# Altium project PCB_15122020_01BB.PrjPcb (part 1 of 9)
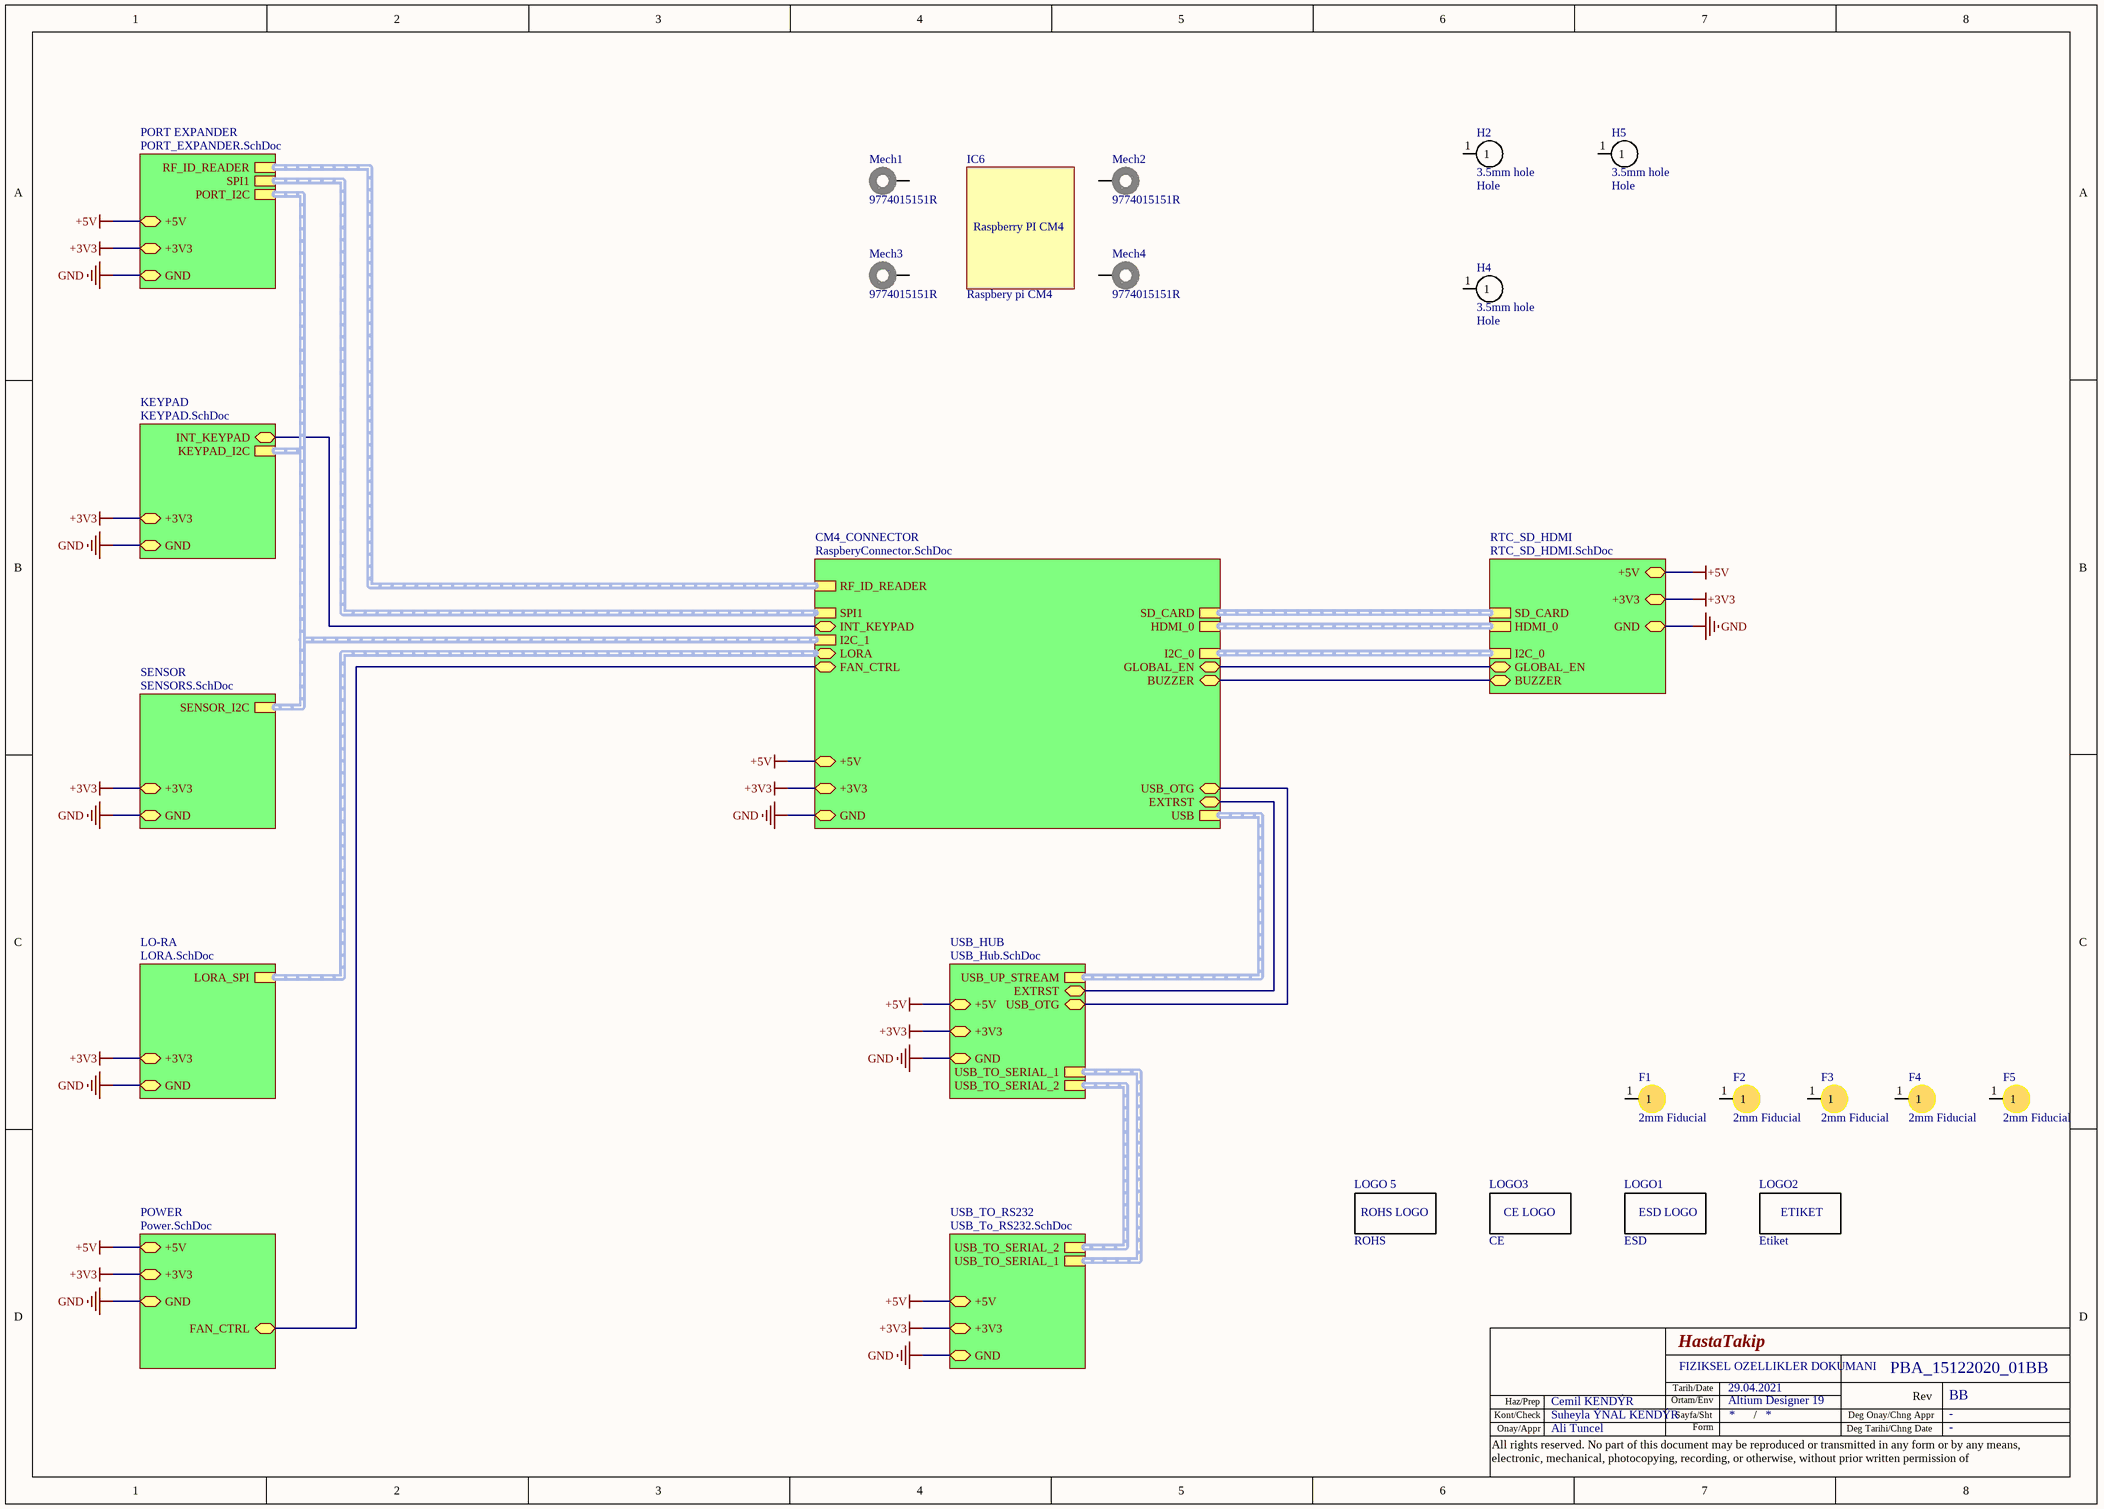
[diagram p0: Main.SchDoc]
DocumentName: FIZIKSEL OZELLIKLER DOKUMANI; FO_ApprovedBy: -; FO_CheckedBy: Cemil KENDÝR; pApprovedBy: Ali Tuncel; pCheckedBy: Suheyla ÝNAL KENDÝR; pDesignedBy: Cemil KENDÝR; pDesignEnvironment: Altium Designer 19; pDocumentNumber: PBA_15122020_01BB; pDrawnBy: Cemil KENDÝR; pFoDate: 29.04.2021; pFoRevision: 01; pModifiedBy: -; pModifiedDate: -; pPBACode: 01; pPBADescription: HastaTakip; pPBARevision: BB; pPreparedBy: Cemil KENDÝR; pProjectCode: 15122020; pProjectName: Hasta Takip; pReleaseDate: 29.04.2021
9 sheets, 663 parts. Net scope: hierarchical (ports join the sheet entries above them; power ports are global).
Board file: PCB_15122020_01BB.PcbDoc
Sheets:
  Main.SchDoc
    USB_TO_RS232 = USB_To_RS232.SchDoc
      RS232_1 = RS232.SchDoc
      RS232_2 = RS232.SchDoc
      RS232_3 = RS232.SchDoc
      RS232_4 = RS232.SchDoc
      RS232_5 = RS232.SchDoc
      RS232_6 = RS232.SchDoc
      RS232_7 = RS232.SchDoc
      RS232_8 = RS232.SchDoc
    USB_HUB = USB_Hub.SchDoc
    CM4_CONNECTOR = RaspberyConnector.SchDoc
    POWER = Power.SchDoc
    PORT EXPANDER = PORT_EXPANDER.SchDoc
    SENSOR = SENSORS.SchDoc
    RTC_SD_HDMI = RTC_SD_HDMI.SchDoc

## Sheet Main.SchDoc
size A3

### Parts
F1  2mm Fiducial  [2mm Fiducial]
F2  2mm Fiducial  [2mm Fiducial]
F3  2mm Fiducial  [2mm Fiducial]
F4  2mm Fiducial  [2mm Fiducial]
F5  2mm Fiducial  [2mm Fiducial]
H2  3.5mm hole  Category: Hole  [3.5mm hole]
H4  3.5mm hole  Category: Hole  [3.5mm hole]
H5  3.5mm hole  Category: Hole  [3.5mm hole]
IC6  Raspbery pi CM4  [CM4_BOARD_SIDE]
LOGO1  ESD  [ESD]
LOGO2  Etiket  [ETIKET]
LOGO3  CE  [CE]
LOGO_5  ROHS  [ROHS]
Mech1  9774015151R  [9774015151]
Mech2  9774015151R  [9774015151]
Mech3  9774015151R  [9774015151]
Mech4  9774015151R  [9774015151]

### Sub-sheets
CM4_CONNECTOR = RaspberyConnector.SchDoc: USB (harness USB), +5V (bidir), +3V3 (bidir), GND (bidir), HDMI_0 (harness HDMI), I2C_0 (harness I2C), GLOBAL_EN (bidir), BUZZER (bidir), SD_CARD (harness SD_CARD), EXTRST (bidir), I2C_1 (harness I2C), INT_KEYPAD (bidir), SPI1 (harness SPI), RF_ID_READER (harness SPI), LORA (bidir, harness SPI), FAN_CTRL (bidir), USB_OTG (bidir)
KEYPAD = KEYPAD.SchDoc (file not in this document): KEYPAD_I2C (harness I2C), INT_KEYPAD (bidir), +3V3 (bidir), GND (bidir)
LO-RA = LORA.SchDoc (file not in this document): +3V3 (bidir), GND (bidir), LORA_SPI (harness SPI)
PORT EXPANDER = PORT_EXPANDER.SchDoc: +3V3 (bidir), GND (bidir), PORT_I2C (harness I2C), SPI1 (harness SPI), RF_ID_READER (harness SPI), +5V (bidir)
POWER = Power.SchDoc: +5V (bidir), +3V3 (bidir), GND (bidir), FAN_CTRL (bidir)
RTC_SD_HDMI = RTC_SD_HDMI.SchDoc: +5V (bidir), +3V3 (bidir), GND (bidir), I2C_0 (harness I2C), HDMI_0 (harness HDMI), GLOBAL_EN (bidir), BUZZER (bidir), SD_CARD (harness SD_CARD)
SENSOR = SENSORS.SchDoc: SENSOR_I2C (harness I2C), +3V3 (bidir), GND (bidir)
USB_HUB = USB_Hub.SchDoc: USB_UP_STREAM (harness USB), USB_TO_SERIAL_1 (harness USB), USB_TO_SERIAL_2 (harness USB), +5V (bidir), +3V3 (bidir), GND (bidir), EXTRST (bidir), USB_OTG (bidir)
USB_TO_RS232 = USB_To_RS232.SchDoc: USB_TO_SERIAL_2 (harness USB), USB_TO_SERIAL_1 (harness USB), +3V3 (bidir), GND (bidir), +5V (bidir)

### Nets
+3V3: sheet USB_TO_RS232/+3V3, sheet USB_HUB/+3V3, sheet CM4_CONNECTOR/+3V3, sheet POWER/+3V3, sheet KEYPAD/+3V3, sheet PORT EXPANDER/+3V3, sheet SENSOR/+3V3, sheet LO-RA/+3V3, sheet RTC_SD_HDMI/+3V3
+5V: sheet USB_TO_RS232/+5V, sheet USB_HUB/+5V, sheet CM4_CONNECTOR/+5V, sheet POWER/+5V, sheet PORT EXPANDER/+5V, sheet RTC_SD_HDMI/+5V
GND: sheet USB_TO_RS232/GND, sheet USB_HUB/GND, sheet CM4_CONNECTOR/GND, sheet POWER/GND, sheet KEYPAD/GND, sheet PORT EXPANDER/GND, sheet SENSOR/GND, sheet LO-RA/GND, sheet RTC_SD_HDMI/GND
BUZZER: sheet CM4_CONNECTOR/BUZZER, sheet RTC_SD_HDMI/BUZZER
GLOBAL_EN_PIN: sheet CM4_CONNECTOR/GLOBAL_EN, sheet RTC_SD_HDMI/GLOBAL_EN
GPIO19: sheet CM4_CONNECTOR/INT_KEYPAD, sheet KEYPAD/INT_KEYPAD
GPIO23: sheet CM4_CONNECTOR/FAN_CTRL, sheet POWER/FAN_CTRL
nEXTRST: sheet USB_HUB/EXTRST, sheet CM4_CONNECTOR/EXTRST
USB_OTG_ID: sheet USB_HUB/USB_OTG, sheet CM4_CONNECTOR/USB_OTG

Not connected (* = marked no-connect by the designer): F1 1; F2 1; F3 1; F4 1; F5 1; H2 1; H4 1; H5 1; Mech1 1; Mech2 1; Mech3 1; Mech4 1

### Buses and harness runs
harness sheet CM4_CONNECTOR/HDMI_0 = sheet RTC_SD_HDMI/HDMI_0
harness sheet CM4_CONNECTOR/I2C_0 = sheet RTC_SD_HDMI/I2C_0
harness sheet CM4_CONNECTOR/I2C_1 = sheet KEYPAD/KEYPAD_I2C = sheet PORT EXPANDER/PORT_I2C = sheet SENSOR/SENSOR_I2C
harness sheet CM4_CONNECTOR/LORA = sheet LO-RA/LORA_SPI
harness sheet CM4_CONNECTOR/RF_ID_READER = sheet PORT EXPANDER/RF_ID_READER
harness sheet CM4_CONNECTOR/SD_CARD = sheet RTC_SD_HDMI/SD_CARD
harness sheet CM4_CONNECTOR/SPI1 = sheet PORT EXPANDER/SPI1
harness sheet CM4_CONNECTOR/USB = sheet USB_HUB/USB_UP_STREAM
harness sheet USB_HUB/USB_TO_SERIAL_1 = sheet USB_TO_RS232/USB_TO_SERIAL_1
harness sheet USB_HUB/USB_TO_SERIAL_2 = sheet USB_TO_RS232/USB_TO_SERIAL_2

### Notes on the sheet
- Tarih/Date
- Kont/Check
- Onay/Appr
- Haz/Prep
- Ortam/Env
- Sayfa/Sht
- Form
- /
- Deg Tarihi/Chng Date
- Deg Onay/Chng Appr
- Rev
- All rights reserved. No part of this document may be reproduced or transmitted in any form or by any means, electronic, mechanical, photocopying, recording, or otherwise, without prior written permission of
- (in symbol CM4) Raspberry PI CM4
- (in symbol Etiket) ETIKET
- (in symbol ROHS) ROHS LOGO

### Library data of the parts
H2 H4 H5 = 3.5mm hole: 3.5mm delik
IC6 = CM4: Category: Module
LOGO1 = ESD: ESD LOGO; Category: Logo
LOGO2 = Etiket: Etiket kutu; Category: Logo
LOGO3 = CE: CE LOGO
LOGO_5 = ROHS: ROHS Logo
Mech1-Mech4 = 9774015151R: RND STNDFF M2.5X0.45 STEEL 1.5MM; Manufacturer: Wurth Electronics; Plating: Tin; Threaded/Unthreaded: Threaded; Outside Diameter: 0.201inch; Supplier 1: Digi-Key; Supplier Part Number 1: 732-7068-1-ND; Manufacturer Part Number: 9774015151R; Stock 1: 20988; Pricing 1: 1 = 1,09000, 10 = 1,03000, 50 = 0,91800, 100 = 0,84000, 500 = 0,78400 (USD); RoHS: Yes; Material: Steel; Length: 0.114inch; REACH SVHC: Unknown; ComponentLink1URL: http://www.mouser.com/ds/2/445/9774015151R-611426.pdf?src-supplier=Mouser; ComponentLink1Description: http://www.mouser.com/ds/2/445/9774015151R-611426.pdf?src-supplier=Mouser; ComponentLink2URL: http://www.farnell.com/datasheets/1960360.pdf?src-supplier=Farnell; ComponentLink2Description: http://www.farnell.com/datasheets/1960360.pdf?src-supplier=Farnell; ComponentLink3URL: https://media.digikey.com/pdf/Data%20Sheets/Wurth%20Electronics%20PDFs/WA-SMSx_Performance_Flyer.pdf?src-supplier=Digi-Key; ComponentLink3Description: https://media.digikey.com/pdf/Data%20Sheets/Wurth%20Electronics%20PDFs/WA-SMSx_Performance_Flyer.pdf?src-supplier=Digi-Key; ComponentLink4URL: http://www.farnell.com/datasheets/1960360.pdf?src-supplier=Element14; ComponentLink4Description: http://www.farnell.com/datasheets/1960360.pdf?src-supplier=Element14; ComponentLink5URL: http://www.farnell.com/datasheets/1960360.pdf?src-supplier=Newark; ComponentLink5Description: http://www.farnell.com/datasheets/1960360.pdf?src-supplier=Newark; Category: Hardware, Fasteners, Accessories Board Spacers, Standoffs
F1-F5 = 2mm Fiducial: Category: Fiducial